# Altium schematic sheet Sheet2.SchDoc
size A; SheetNumber: 1; SheetTotal: 1
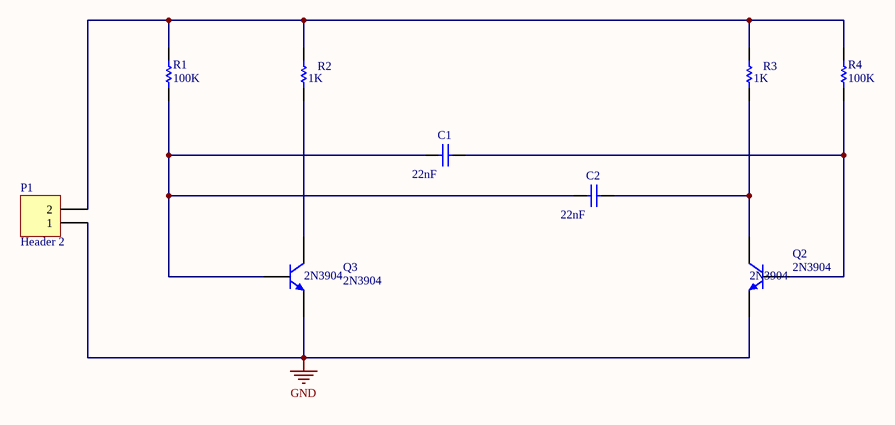
[diagram p0: Sheet2.SchDoc]

## Parts
C1  22nF  [CAP1206]
C2  22nF  [CAP1206]
P1  Header 2  [HDR1X2]
Q2  2N3904  [2N3904]
Q3  2N3904  [2N3904]
R1  100K  [RES1206]
R2  1K  [RES1206]
R3  1K  [RES1206]
R4  100K  [RES1206]

## Nets
GND: P1.1 Q2.1(E) Q3.1(E)
NetC1_1: C1.1 C2.1 Q3.2(B) R1.1
NetC1_2: C1.2 Q2.2(B) R4.1
NetC2_2: C2.2 Q2.3(C) R3.1
NetP1_2: P1.2 R1.2 R2.2 R3.2 R4.2
NetQ3_3: Q3.3(C) R2.1

## Library data of the parts
C1 C2 = CAP SMD PACKAGE: TOTAL CAPACITOR SMD PACK; Designer: Abbas Basereh; Desc.: CAP SMD TOTAL PACKAGES; VALUE: 100nF; Data: 2017-3-10
P1 = Header 2: Header, 2-Pin; LatestRevisionDate: 17-Jul-2002; LatestRevisionNote: Re-released for DXP Platform.; Publisher: Altium Limited
Q2 Q3 = 2N3904: NPN Transistor
R1-R4 = RES SMD PACKAGE: TOTAL SMD RESISTOR PACK; Designer: Abbas Basereh; Desc.: RES SMD PAKAGES; Data: 2017-3-10